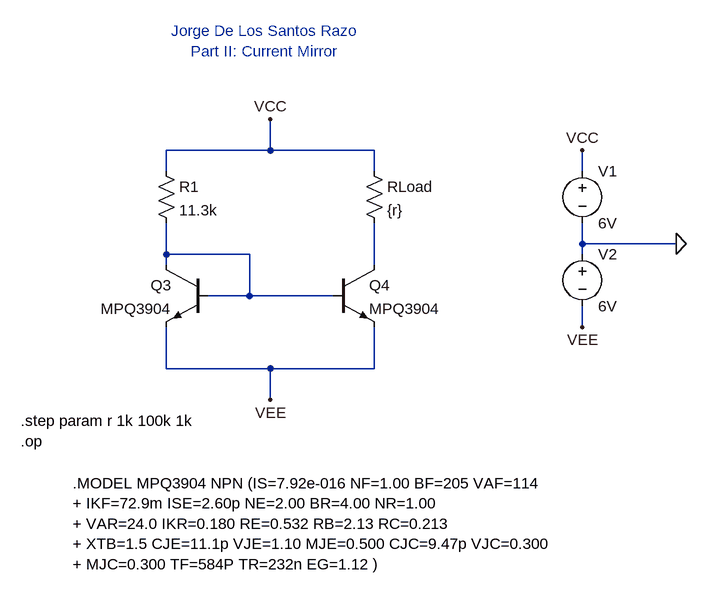
[diagram p0: schematic Current-Mirror.asc]
Current-Mirror.asc, the LTspice schematic file:
Version 4.1
SHEET 1 880 680
WIRE -448 -64 -448 -112
WIRE -448 -64 -608 -64
WIRE -288 -64 -448 -64
WIRE -608 -32 -608 -64
WIRE -288 -32 -288 -64
WIRE 32 -32 32 -64
WIRE 32 80 32 48
WIRE 176 80 32 80
WIRE -608 96 -608 48
WIRE -480 96 -608 96
WIRE 32 96 32 80
WIRE -608 112 -608 96
WIRE -288 112 -288 48
WIRE -480 160 -480 96
WIRE -480 160 -544 160
WIRE -352 160 -480 160
WIRE 32 208 32 176
WIRE -608 272 -608 208
WIRE -448 272 -608 272
WIRE -288 272 -288 208
WIRE -288 272 -448 272
WIRE -448 320 -448 272
FLAG 32 208 VEE
FLAG 32 -64 VCC
FLAG 176 80 0
FLAG -448 320 VEE
FLAG -448 -112 VCC
SYMBOL voltage 32 -48 R0
SYMATTR InstName V1
SYMATTR Value 6V
SYMBOL voltage 32 80 R0
SYMATTR InstName V2
SYMATTR Value 6V
SYMBOL npn -544 112 M0
SYMATTR InstName Q3
SYMATTR Value MPQ3904
SYMBOL npn -352 112 R0
SYMATTR InstName Q4
SYMATTR Value MPQ3904
SYMBOL res -624 -48 R0
SYMATTR InstName R1
SYMATTR Value 11.3k
SYMBOL res -304 -48 R0
SYMATTR InstName RLoad
SYMATTR Value {r}
TEXT -752 448 Left 2 !.MODEL MPQ3904 NPN (IS=7.92e-016 NF=1.00 BF=205 VAF=114\n+ IKF=72.9m ISE=2.60p NE=2.00 BR=4.00 NR=1.00\n+ VAR=24.0 IKR=0.180 RE=0.532 RB=2.13 RC=0.213\n+ XTB=1.5 CJE=11.1p VJE=1.10 MJE=0.500 CJC=9.47p VJC=0.300\n+ MJC=0.300 TF=584P TR=232n EG=1.12 )
TEXT -456 -232 Center 2 ;Jorge De Los Santos Razo\nPart II: Current Mirror
TEXT -832 384 Left 2 !.op
TEXT -832 352 Left 2 !.step param r 1k 100k 1k

The netlist it stands for:
* Current-Mirror.asc
V1 VCC 0 6V
V2 0 VEE 6V
Q3 N001 N001 VEE 0 MPQ3904
Q4 N002 N001 VEE 0 MPQ3904
R1 VCC N001 11.3k
RLoad VCC N002 {r}
.model NPN NPN
.model PNP PNP
.lib standard.bjt
.MODEL MPQ3904 NPN (IS=7.92e-016 NF=1.00 BF=205 VAF=114
+ IKF=72.9m ISE=2.60p NE=2.00 BR=4.00 NR=1.00
+ VAR=24.0 IKR=0.180 RE=0.532 RB=2.13 RC=0.213
+ XTB=1.5 CJE=11.1p VJE=1.10 MJE=0.500 CJC=9.47p VJC=0.300
+ MJC=0.300 TF=584P TR=232n EG=1.12 )
* Jorge De Los Santos Razo
* Part II: Current Mirror
.op
.step param r 1k 100k 1k
.backanno
.end